# Altium project sensor.PrjPcb
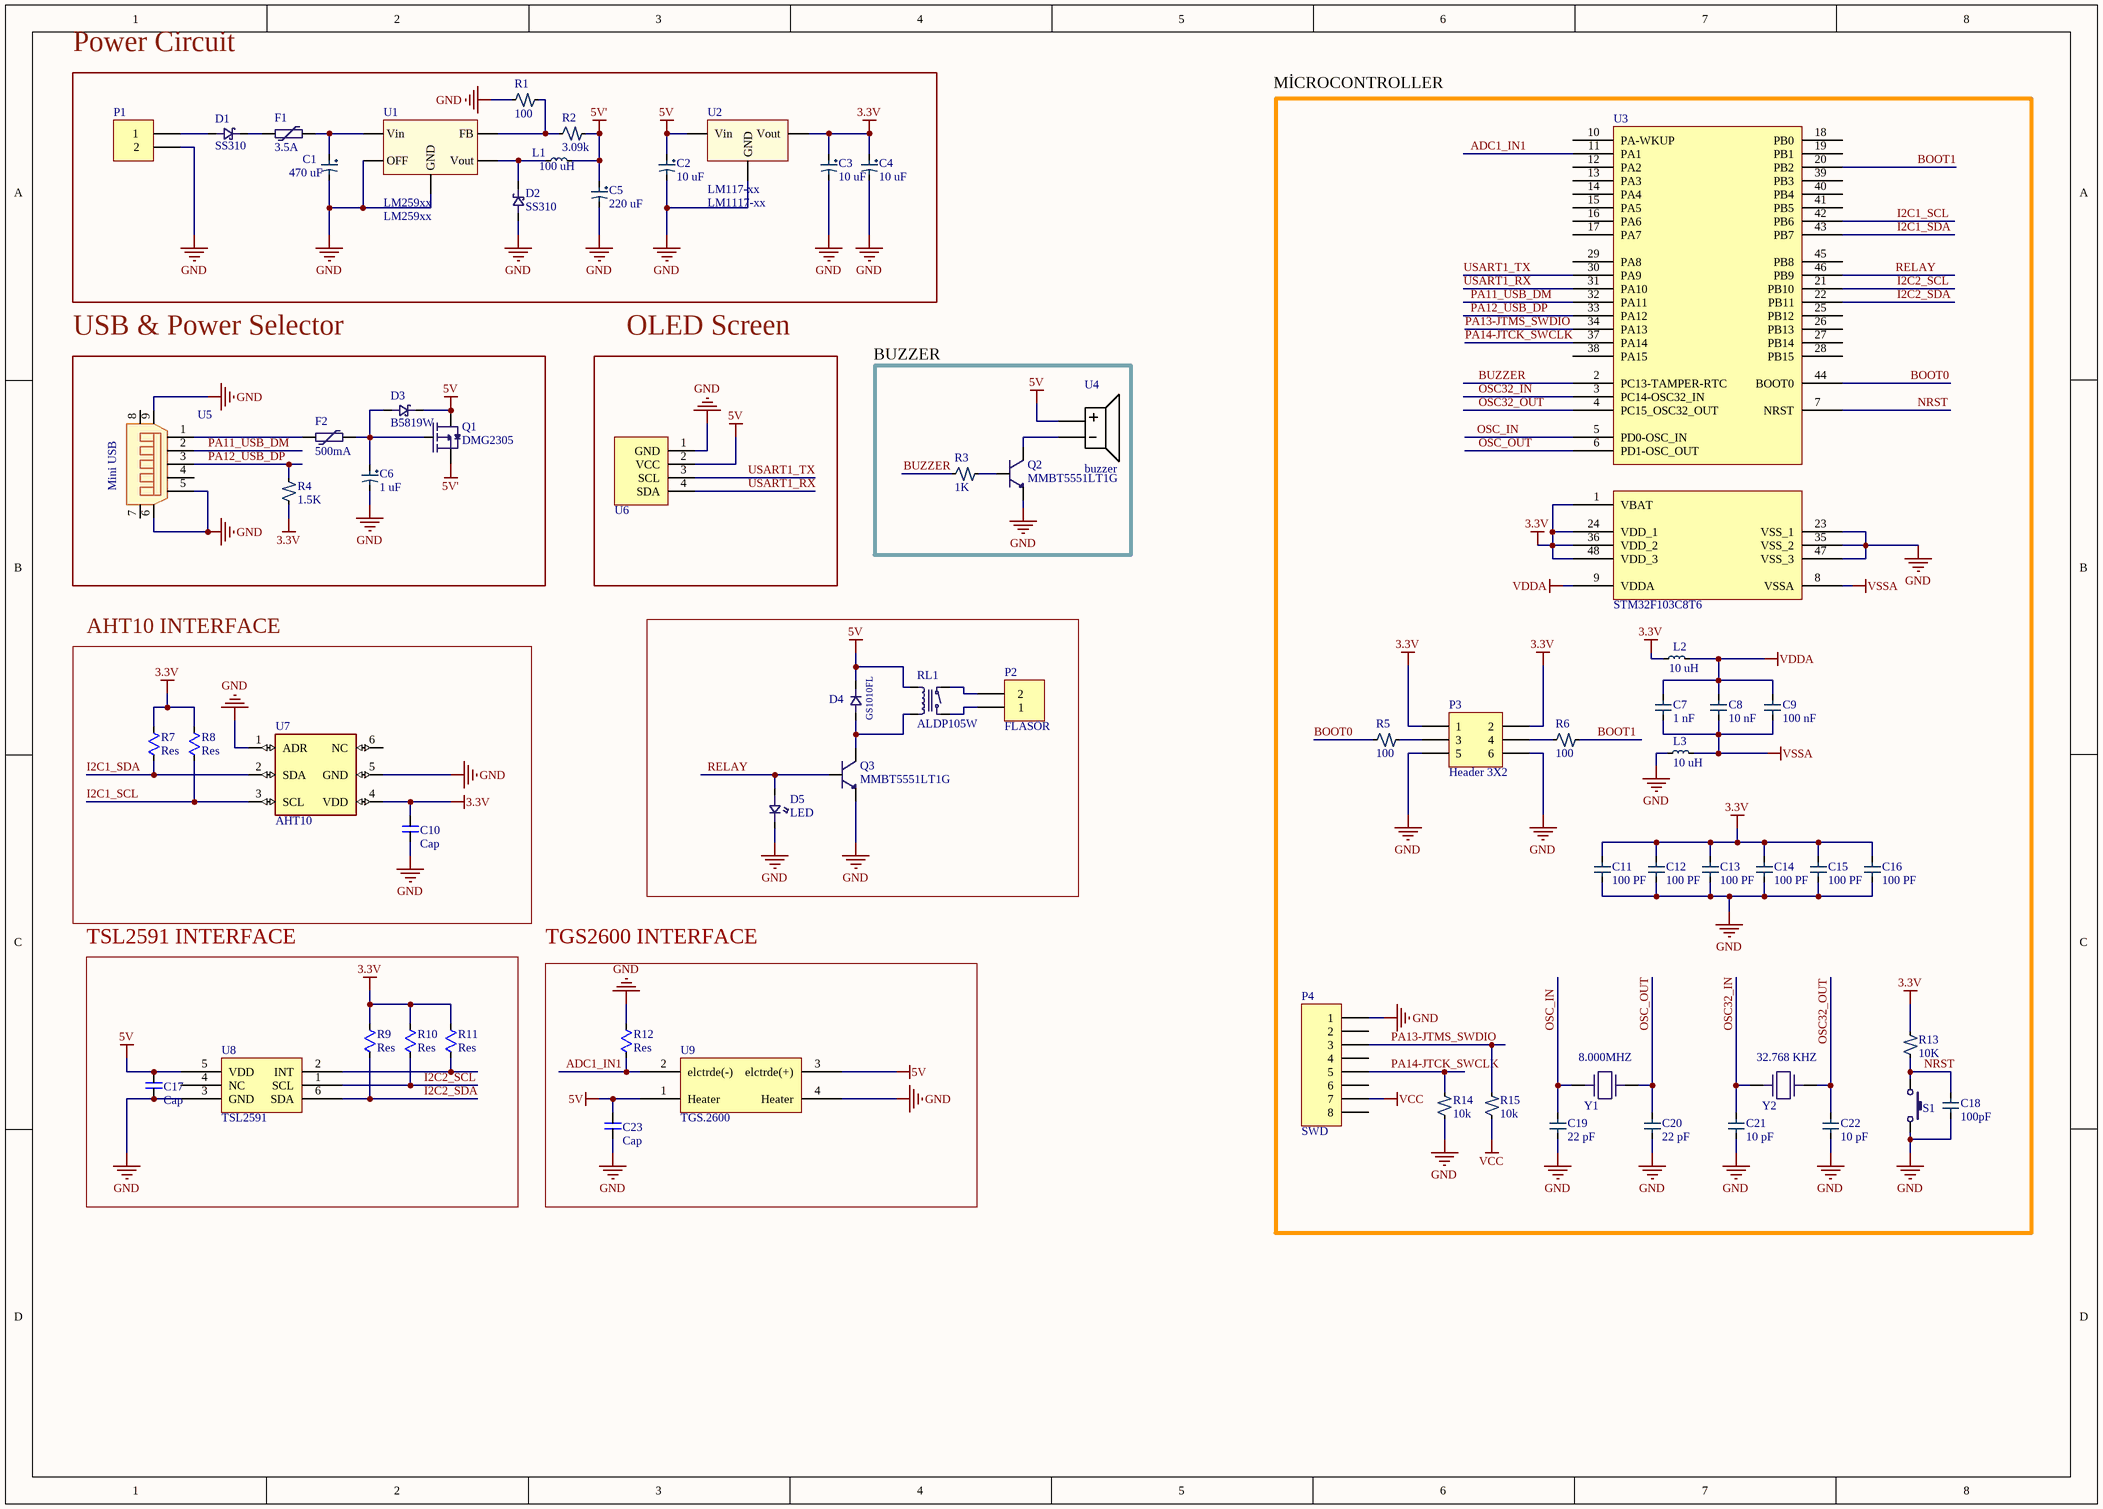
[diagram p0: sensor.SchDoc]
1 sheet, 68 parts. Net scope: global (net labels, ports and power ports of the same name join across sheets).
Board file: sensor.PcbDoc

## Sheet sensor.SchDoc
size A3; SheetNumber: 1; SheetTotal: 1

### Parts
C1  470 uF  [10X10.5 Cap]
C2  10 uF  [Case A]
C3  10 uF  [Case A]
C4  10 uF  [Case A]
C5  220 uF  [10X10.5 Cap]
C6  1 uF  [Case A]
C7  1 nF  [0603 CAP]
C8  10 nF  [0603 CAP]
C9  100 nF  [0603 CAP]
C10  Cap  [0805 Cap]
C11  100 PF  [0603 CAP]
C12  100 PF  [0603 CAP]
C13  100 PF  [0603 CAP]
C14  100 PF  [0603 CAP]
C15  100 PF  [0603 CAP]
C16  100 PF  [0603 CAP]
C17  Cap  [0603 CAP]
C18  100pF  [0603 CAP]
C19  22 pF  [0603 CAP]
C20  22 pF  [0603 CAP]
C21  10 pF  [0603 CAP]
C22  10 pF  [0603 CAP]
C23  Cap  [0603 CAP]
D1  SS310  [DO-214AA]
D2  SS310  [DO-214AA]
D3  B5819W  [SOD123]
D4  GS1010FL  [SOD123FL]
D5  LED  [0603 Led]
F1  3.5A  [6125 Fuse]
F2  500mA  [6125 Fuse]
L1  100 uH  [12X12X5MM INDUCTOR]
L2  10 uH  [0603 IND]
L3  10 uH  [0603 IND]
P1  Klemens 5.08  [KLEMENS 5.08MM-2]  (value not drawn)
P2  FLASÖR  [KLEMENS 5.08MM-2]
P3  Header 3X2  [HDR2X3]
P4  SWD  [2X4 BOX HEADER]
Q1  DMG2305  [SOT23]
Q2  MMBT5551LT1G  [SOT23]
Q3  MMBT5551LT1G  [SOT23]
R1  100  [0603 RES]
R2  3.09k  [0603 RES]
R3  1K  [0603 RES]
R4  1.5K  [0603 RES]
R5  100  [0603 RES]
R6  100  [0603 RES]
R7  Res  [0603 RES]
R8  Res  [0603 RES]
R9  Res  [0603 RES]
R10  Res  [0603 RES]
R11  Res  [0603 RES]
R12  Res  [0603 RES]
R13  10K  [0603 RES]
R14  10k  [0603 RES]
R15  10k  [0603 RES]
RL1  ALDP105W  [SPST-NO (1 Form A)]
S1  Switch  [6x6mm Tach Switch]  (value not drawn)
U1  LM259xx  [d2pak-5]
U2  LM117-xx  value LM1117-xx  [SOT223-3]
U3  STM32F103C8T6  [LQFP48]
U4  buzzer  [BUZZER]
U5  Mini USB  [MİNİ USB]
U6  OLED 128X32  [128x32 OLED]  (value not drawn)
U7  AHT10  [AHT_QFN]
U8  TSL2591  [SON65P200X200X90-7N]
U9  TGS.2600  [TO180P920H1340-4]
Y1  8.000MHZ  [SMD-2 XTAL]
Y2  32.768 KHZ  [3.20x1.50x0.80]

### Blocks framed on the sheet
Power Circuit: C1-C5 D1 D2 F1 L1 P1 R1 R2 U1 U2
MİCROCONTROLLER: C7-C9 C11-C16 C18-C22 L2 L3 P3 P4 R5 R6 R13-R15 S1 U3 Y1 Y2
USB & Power Selector: C6 D3 F2 Q1 R4 U5
OLED Screen: U6
BUZZER: Q2 R3 U4
AHT10 INTERFACE: C10 R7 R8 U7
TSL2591 INTERFACE: C17 R9-R11 U8
TGS2600 INTERFACE: C23 R12 U9

### Nets
3.3V: C3.1 C4.1 C10.1 C11.2 C12.2 C13.2 C14.2 C15.2 C16.2 L2.1 P3.1 P3.2 R4.1 R7.2 R8.2 R9.2 R10.2 R11.2 R13.2 U2.2(Vout) U3.1(VBAT) U3.24(VDD_1) U3.36(VDD_2) U3.48(VDD_3) U7.4(VDD)
5V: C2.1 C17.1 C23.1 D3.2(Cathode) D4.2(Cathode) Q1.3(Drain) RL1.1(Coil1) U2.3(Vin) U4.1 U6.2(VCC) U8.5(VDD) U9.1(Heater) U9.3(elctrde(+))
5V': C5.1 L1.2 Q1.2(Source) R2.2
GND: C1.2 C2.2 C3.2 C4.2 C5.2 C6.2 C10.2 C11.1 C12.1 C13.1 C14.1 C15.1 C16.1 C17.2 C18.1 C19.1 C20.1 C21.1 C22.1 C23.2 D2.1(Anode) D5.2(Cathode) L3.1 P1.2 P3.5 P3.6 P4.1 Q2.2(Emitter) Q3.2(Emitter) R1.1 R12.2 R14.1 S1.2 U1.3(GND) U1.5(OFF) U2.1(GND) U3.23(VSS_1) U3.35(VSS_2) U3.47(VSS_3) U5.5(GND) U5.6 U5.9 U6.1(GND) U7.1(ADR) U7.5(GND) U8.3(GND) U9.4(Heater)
VCC: P4.7 R15.1
VDDA: C7.2 C8.2 C9.2 L2.2 U3.9(VDDA)
VSSA: C7.1 C8.1 C9.1 L3.2 U3.8(VSSA)
ADC1_IN1: R12.1 U3.11(PA1) U9.2(elctrde(-))
BOOT0: R5.1 U3.44(BOOT0)
BOOT1: R6.2 U3.20(PB2)
BUZZER: R3.1 U3.2(PC13-TAMPER-RTC)
I2C1_SCL: R8.1 U3.42(PB6) U7.3(SCL)
I2C1_SDA: R7.1 U3.43(PB7) U7.2(SDA)
I2C2_SCL: R10.1 U3.21(PB10) U8.1(SCL)
I2C2_SDA: R9.1 U3.22(PB11) U8.6(SDA)
NRST: C18.2 R13.1 S1.1 U3.7(NRST)
OSC32_IN: C21.2 U3.3(PC14-OSC32_IN) Y2.1
OSC32_OUT: C22.2 U3.4(PC15_OSC32_OUT) Y2.2
OSC_IN: C19.2 U3.5(PD0-OSC_IN) Y1.1
OSC_OUT: C20.2 U3.6(PD1-OSC_OUT) Y1.2
PA11_USB_DM: U3.32(PA11) U5.2(D-)
PA12_USB_DP: R4.2 U3.33(PA12) U5.3(D+)
PA13-JTMS_SWDIO: P4.3 R15.2 U3.34(PA13)
PA14-JTCK_SWCLK: P4.5 R14.2 U3.37(PA14)
RELAY: D5.1(Anode) Q3.1(Base) U3.46(PB9)
USART1_RX: U3.31(PA10) U6.4(SDA)
USART1_TX: U3.30(PA9) U6.3(SCL)
NetC1_1: C1.1 F1.2 U1.1(Vin)
NetC6_1: C6.1 D3.1(Anode) F2.2 Q1.1(Gate)
NetD1_1: D1.1(Anode) P1.1
NetD1_2: D1.2(Cathode) F1.1
NetD2_2: D2.2(Cathode) L1.1 U1.2(Vout)
NetD4_1: D4.1(Anode) Q3.3(Collector) RL1.2(Coil2)
NetF2_1: F2.1 U5.1(Vbus)
NetP2_1: P2.1 RL1.4(NO)
NetP2_2: P2.2 RL1.3(Com)
NetP3_3: P3.3 R5.2
NetP3_4: P3.4 R6.1
NetQ2_1: Q2.1(Base) R3.2
NetQ2_3: Q2.3(Collector) U4.2
NetR1_2: R1.2 R2.1 U1.4(FB)
NetR11_1: R11.1 U8.2(INT)

Not connected (* = marked no-connect by the designer): P4 2 4 6 8; U3 10(PA-WKUP) 12(PA2) 13(PA3) 14(PA4) 15(PA5) 16(PA6) 17(PA7) 18(PB0) 19(PB1) 25(PB12) 26(PB13) 27(PB14) 28(PB15) 29(PA8) 38(PA15) 39(PB3) 40(PB4) 41(PB5) 45(PB8); U5 4(IN) 7 8; U7 6(NC); U8 4(NC)

### Library data of the parts
C1-C6 = Capasitor Pole: Cap Pole
C7-C9 C11-C16 C18-C22 = Capasitor: Cap SMD
C10 C17 C23 = Cap: Cap Small
D1 D2 = SS310-DO214AA-HT: DIODE SCHOTTKY 3A 100V DO-214AA SMB HOTTECH; ComponentLink1Description: Özdisan; ComponentLink1URL: https://ozdisan.com/guc-yari-iletkenleri/diyotlar-modul-diyotlar-ve-dogrultucular/schottky-diyotlar/SS310-DO214AA-HT
D3 = B5819W: DIODE SCHOTTKY 1A 40V SOD123
D4 = GS1010FL_R1_00001: DIODE STAND. Single 1A 1000V SMT SOD123FL; ComponentLink1Description: Özdisan; ComponentLink1URL: https://ozdisan.com/guc-yari-iletkenleri/diyotlar-modul-diyotlar-ve-dogrultucular/genel-amacli-diyotlar/GS1010FLR100001
F1 F2 = SMD Fuse: 25H0500G 125V 500mA 6125 SMD Sigorta; ComponentLink1Description: Karaköy; ComponentLink1URL: https://karakoyelektronik.com/smd-sigorta/25h0500g-125v-500ma-6125-smd-sigorta-14287
L1-L3 = Inductor: IND SMD
P1 P2 = Klemens 5.08 2 pin: 2 Pin 5.08mm 90° Erkek Geçmeli Turuncu Klemens
P3 = Header 3X2: Header, 3-Pin, Dual row; LatestRevisionDate: 17-Jul-2002; LatestRevisionNote: Re-released for DXP Platform.; Publisher: Altium Limited
P4 = FEMALE HEADER 2X4 90C: ComponentLink1Description: Direnc.net; ComponentLink1URL: https://www.direnc.net/2x40-90c-disi-header
Q1 = DMG2305: MOSFET DIS.4.2A 20V P-CH SOT23 ENHANCEMENT SMT
Q2 Q3 = MMBT5551LT1G: TRANSISTOR DIS.600mA 160V NPN SOT23 H.VOLT SMT; ComponentLink1Description: Özdisan; ComponentLink1URL: https://ozdisan.com/guc-yari-iletkenleri/transistorler/discrete-transistorler/MMBT5551LT1G
R1-R6 R13-R15 = Resistor: Res SMD
R7-R12 = Res: Res Small
RL1 = ALDP105W: RELAY 5A 5V 1a PANASONIC; ComponentLink1Description: Özdisan; ComponentLink1URL: https://ozdisan.com/Product/Detail/344650/ALDP105W
S1 = Switch Tach V/T: SWITCH TACT 6.00x6.00 4.30mm 250gF SMT V/T; ComponentLink1Description: Özdisan; ComponentLink1URL: https://ozdisan.com/elektromekanik-komponentler/sivicler-ve-anahtarlar/tact-sivicler/DS1042-03-1-1-KKR-250-10
U1 = LM259xx: Voltaga Regulator; Value: LM259xx
U2 = LM117-xx: Voltaga Regulator
U3 = STM32F103C8T6TR: IC-32F103C MCU 32BIT 64KB FLASH 48LQFP; ComponentLink1Description: Özdisan; ComponentLink1URL: https://www.ozdisan.com/entegre-devreler-ics/embedded-entegreler/mikroislemciler/STM32F103C8T6TR
U5 = Mini USB: CONNECTORUSB MINI B TYPE 5PIN SMT R/A FEMALE; ComponentLink1Description: altanelektronik; ComponentLink1URL: https://www.altanelektronik.net/urun/usb-mini-b-smd-konnektor?gclid=Cj0KCQiA8dH-BRD_ARIsAC24umaDNgCGVtIfEyBhhV811Ozl2_uafImqUi-xUc2deYwysfaslKOq67gaAoMmEALw_wcB
U6 = OLED 128X32: 128x32 Oled Lcd Ekran 0.91 Inch SSD1306
U7 = AHT10: Temperature and humidity sensor; MF: Asair; SnapEDA_Link: https://www.snapeda.com/parts/AHT10/Asair/view-part/?ref=snap; Price: None; Check_prices: https://www.snapeda.com/parts/AHT10/Asair/view-part/?ref=eda; Package: Package; Availability: Not in stock; Value: *; MP: AHT10
Y1 = 8 MHZ XTAL: CRYSTAL 8MHZ 18PF 2-SMD ABRACON; ComponentLink1Description: Özdisan; ComponentLink1URL: https://ozdisan.com/pasif-komponentler/kristaller-osilatorler-ve-rezanatorler/kristaller/ABM7-8-000MHZ-D2Y-T; ComponentLink2Description: New link; ComponentLink2URL: *
Y2 = 32.7680kHz: CRYSTAL 32.7680kHz 12.5pF 20ppm; ComponentLink1Description: Özdisan; ComponentLink1URL: https://ozdisan.com/pasif-komponentler/kristaller-osilatorler-ve-rezanatorler/kristaller/RT2012-32-768-12-5-20-EX